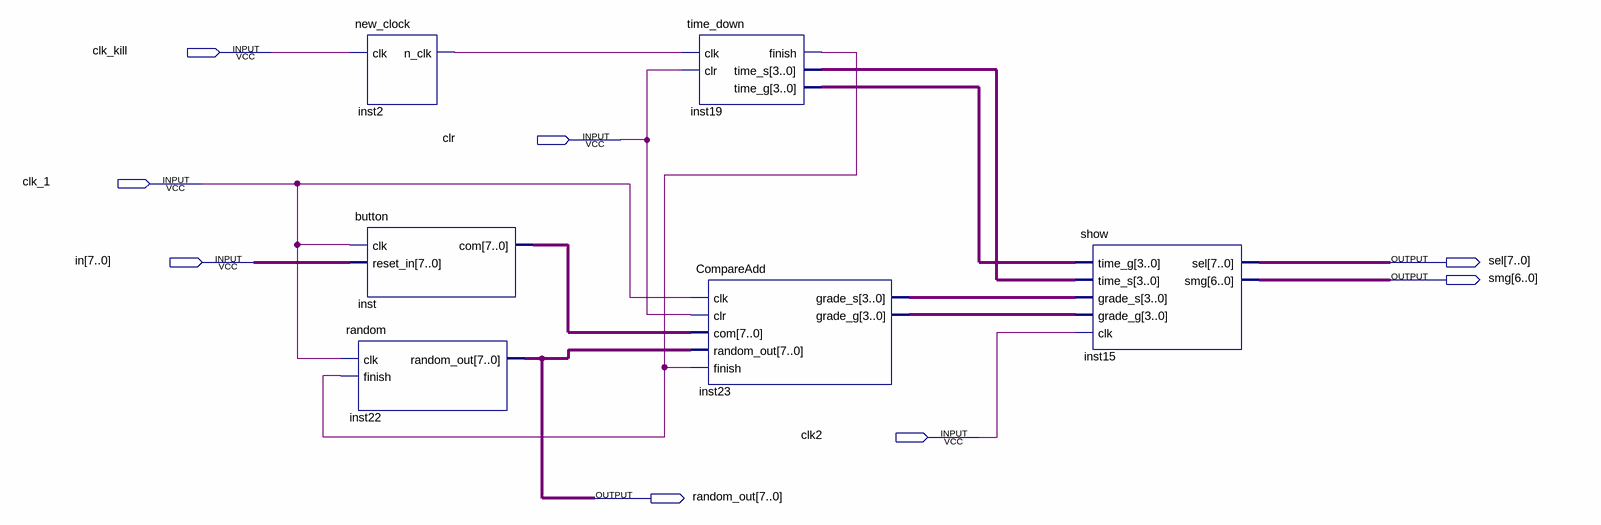
[diagram p0: schematic sheet]
// Quartus schematic test.bdf as structural Verilog: 6 symbols, 8 pins
module test (
  input  clk_kill,
  input  clr,
  input  clk_1,
  input  [7:0] in,
  input  clk2,
  output [7:0] sel,
  output [6:0] smg,
  output [7:0] random_out
);

  wire inst2_n_clk, inst19_finish;
  wire [3:0] inst19_time_g, inst19_time_s, inst23_grade_g, inst23_grade_s;
  wire [7:0] inst_com;

  new_clock inst2 (.clk(clk_kill), .n_clk(inst2_n_clk));
  button inst (.clk(clk_1), .reset_in(in), .com(inst_com));
  random inst22 (.clk(clk_1), .finish(inst19_finish), .random_out(random_out));
  time_down inst19 (
    .clk(inst2_n_clk), .clr(clr), .finish(inst19_finish), .time_s(inst19_time_s), .time_g(inst19_time_g));
  CompareAdd inst23 (
    .clk(clk_1), .clr(clr), .com(inst_com), .random_out(random_out), .finish(inst19_finish),
    .grade_s(inst23_grade_s), .grade_g(inst23_grade_g));
  show inst15 (
    .time_g(inst19_time_g), .time_s(inst19_time_s), .grade_s(inst23_grade_s), .grade_g(inst23_grade_g),
    .clk(clk2), .sel(sel), .smg(smg));
endmodule
